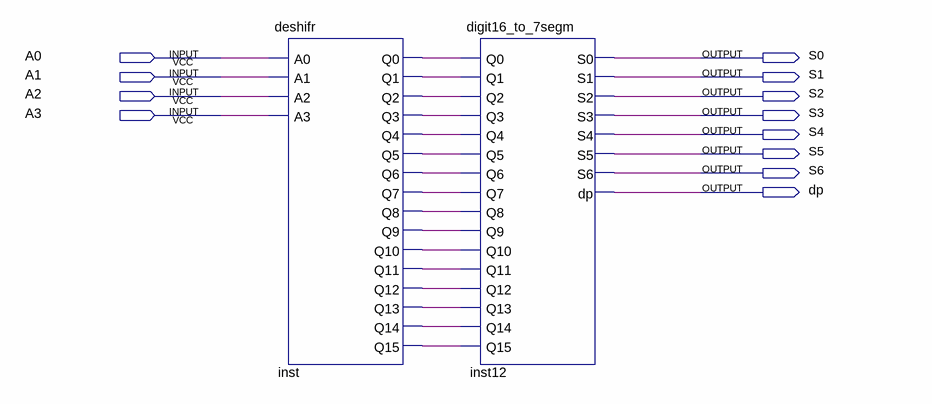
[diagram p0: schematic sheet]
// Quartus schematic Lab3_2.bdf as structural Verilog: 2 symbols, 12 pins
module Lab3_2 (
  input  A0,
  input  A1,
  input  A2,
  input  A3,
  output S0,
  output S1,
  output S2,
  output S3,
  output S4,
  output S5,
  output S6,
  output dp
);

  wire inst_q0, inst_q1, inst_q2, inst_q3, inst_q4, inst_q5, inst_q6, inst_q7, inst_q8, inst_q9, inst_q10,
       inst_q11, inst_q12, inst_q13, inst_q14, inst_q15;

  deshifr inst (
    .A0(A0), .A1(A1), .A2(A2), .A3(A3), .Q0(inst_q0), .Q1(inst_q1), .Q2(inst_q2), .Q3(inst_q3), .Q4(inst_q4),
    .Q5(inst_q5), .Q6(inst_q6), .Q7(inst_q7), .Q8(inst_q8), .Q9(inst_q9), .Q10(inst_q10), .Q11(inst_q11),
    .Q12(inst_q12), .Q13(inst_q13), .Q14(inst_q14), .Q15(inst_q15));
  digit16_to_7segm inst12 (
    .Q0(inst_q0), .Q1(inst_q1), .Q2(inst_q2), .Q3(inst_q3), .Q4(inst_q4), .Q5(inst_q5), .Q6(inst_q6),
    .Q7(inst_q7), .Q8(inst_q8), .Q9(inst_q9), .Q10(inst_q10), .Q11(inst_q11), .Q12(inst_q12), .Q13(inst_q13),
    .Q14(inst_q14), .Q15(inst_q15), .S0(S0), .S1(S1), .S2(S2), .S3(S3), .S4(S4), .S5(S5), .S6(S6), .dp(dp));
endmodule
